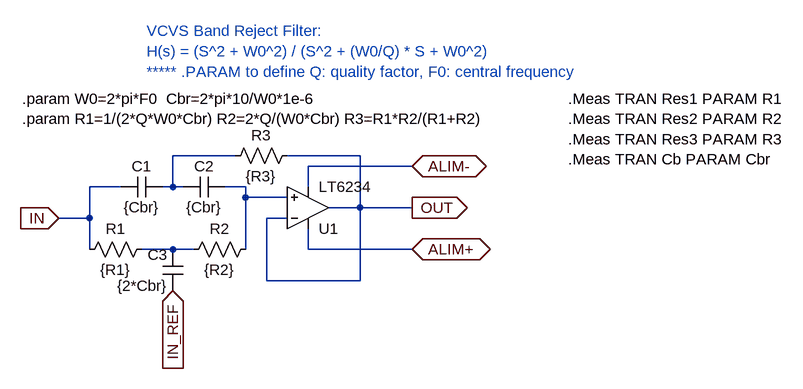
[diagram p0: schematic band-reject-lt6234-SUB.asc]
band-reject-lt6234-SUB.asc, the LTspice schematic file:
Version 4
SHEET 1 1232 680
WIRE 272 16 176 16
WIRE 464 16 352 16
WIRE 544 32 384 32
WIRE 96 64 48 64
WIRE 176 64 176 16
WIRE 176 64 160 64
WIRE 192 64 176 64
WIRE 288 64 256 64
WIRE 384 64 384 32
WIRE 288 80 288 64
WIRE 352 80 288 80
WIRE 464 96 464 16
WIRE 464 96 416 96
WIRE 544 96 464 96
WIRE 48 112 48 64
WIRE 48 112 0 112
WIRE 352 112 320 112
WIRE 48 160 48 112
WIRE 176 160 128 160
WIRE 208 160 176 160
WIRE 288 160 288 80
WIRE 384 160 384 128
WIRE 544 160 384 160
WIRE 320 208 320 112
WIRE 464 208 464 96
WIRE 464 208 320 208
FLAG 176 224 IN_REF
IOPIN 176 224 In
FLAG 0 112 IN
IOPIN 0 112 In
FLAG 544 160 ALIM+
IOPIN 544 160 BiDir
FLAG 544 32 ALIM-
IOPIN 544 32 BiDir
FLAG 544 96 OUT
IOPIN 544 96 Out
SYMBOL cap 160 48 R90
WINDOW 0 0 32 VBottom 2
WINDOW 3 32 32 VTop 2
SYMATTR InstName C1
SYMATTR Value {Cbr}
SYMBOL cap 256 48 R90
WINDOW 0 0 32 VBottom 2
WINDOW 3 32 32 VTop 2
SYMATTR InstName C2
SYMATTR Value {Cbr}
SYMBOL cap 192 224 R180
WINDOW 0 24 56 Left 2
WINDOW 3 24 8 Left 2
SYMATTR InstName C3
SYMATTR Value {2*Cbr}
SYMBOL res 144 144 R90
WINDOW 0 0 56 VBottom 2
WINDOW 3 32 56 VTop 2
SYMATTR InstName R1
SYMATTR Value {R1}
SYMBOL res 304 144 R90
WINDOW 0 0 56 VBottom 2
WINDOW 3 32 56 VTop 2
SYMATTR InstName R2
SYMATTR Value {R2}
SYMBOL res 368 0 R90
WINDOW 0 0 56 VBottom 2
WINDOW 3 32 56 VTop 2
SYMATTR InstName R3
SYMATTR Value {R3}
SYMBOL Opamps\\LT6234 384 96 M180
SYMATTR InstName U1
TEXT -56 -72 Left 2 !.param W0=2*pi*F0  Cbr=2*pi*10/W0*1e-6\n.param R1=1/(2*Q*W0*Cbr) R2=2*Q/(W0*Cbr) R3=R1*R2/(R1+R2)
TEXT 784 -72 Left 2 !.Meas TRAN Res1 PARAM R1\n.Meas TRAN Res2 PARAM R2\n.Meas TRAN Res3 PARAM R3\n.Meas TRAN Cb PARAM Cbr
TEXT 136 -176 Left 2 ;VCVS Band Reject Filter:\nH(s) = (S^2 + W0^2) / (S^2 + (W0/Q) * S + W0^2)\n***** .PARAM to define Q: quality factor, F0: central frequency

The netlist it stands for:
* band-reject-lt6234-SUB.asc
C1 N001 IN {Cbr}
C2 N002 N001 {Cbr}
C3 IN_REF N003 {2*Cbr}
R1 N003 IN {R1}
R2 N002 N003 {R2}
R3 OUT N001 {R3}
* U1: LT6234 (symbol Opamps\LT6234 not available, pins judged from their places): In+=N002 In-=OUT V+=ALIM+ V-=ALIM- OUT=OUT
.param W0=2*pi*F0  Cbr=2*pi*10/W0*1e-6
.param R1=1/(2*Q*W0*Cbr) R2=2*Q/(W0*Cbr) R3=R1*R2/(R1+R2)
.Meas TRAN Res1 PARAM R1
.Meas TRAN Res2 PARAM R2
.Meas TRAN Res3 PARAM R3
.Meas TRAN Cb PARAM Cbr
* VCVS Band Reject Filter:
* H(s) = (S^2 + W0^2) / (S^2 + (W0/Q) * S + W0^2)
* ***** .PARAM to define Q: quality factor, F0: central frequency
.backanno
.end